# Altium schematic sheet Flash.SchDoc
size 420 x 297 mm
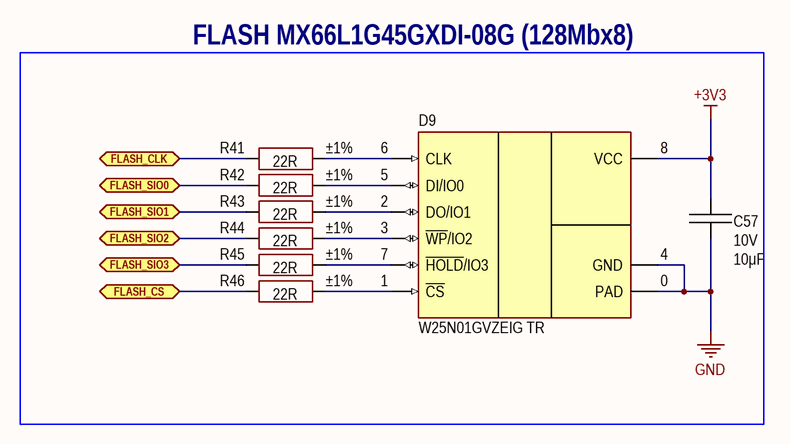
[diagram p0: Flash.SchDoc]

## Parts
C57  value 10μF  Voltage: 10V  [CAP: 0805]
D9  (no value)  [IC: 8-WSON]
R41  value 22R  Tolerance: ±1%  [RES: 0805]
R42  value 22R  Tolerance: ±1%  [RES: 0805]
R43  value 22R  Tolerance: ±1%  [RES: 0805]
R44  value 22R  Tolerance: ±1%  [RES: 0805]
R45  value 22R  Tolerance: ±1%  [RES: 0805]
R46  value 22R  Tolerance: ±1%  [RES: 0805]

## Blocks framed on the sheet
FLASH MX66L1G45GXDI-08G (128Mbx8): C57 D9 R41-R46

## Ports
FLASH_CLK (bidir), FLASH_CS (bidir), FLASH_SIO0 (bidir), FLASH_SIO1 (bidir), FLASH_SIO2 (bidir), FLASH_SIO3 (bidir)

## Nets
+3V3: C57.2 D9.8(VCC)
GND: C57.1 D9.0(PAD) D9.4(GND)
FLASH_CLK: R41.1 ; port FLASH_CLK
FLASH_CS: R46.1 ; port FLASH_CS
FLASH_SIO0: R42.1 ; port FLASH_SIO0
FLASH_SIO1: R43.1 ; port FLASH_SIO1
FLASH_SIO2: R44.1 ; port FLASH_SIO2
FLASH_SIO3: R45.1 ; port FLASH_SIO3
NetD9_1: D9.1(~{CS}) R46.2
NetD9_2: D9.2(DO/IO1) R43.2
NetD9_3: D9.3(~{WP}/IO2) R44.2
NetD9_5: D9.5(DI/IO0) R42.2
NetD9_6: D9.6(CLK) R41.2
NetD9_7: D9.7(~{HOLD}/IO3) R45.2

## Notes on the sheet
- Author
- Manufacturer
- Date
- Page
- Total pages
- Size page
- A3
- Materials

## Library data of the parts
C57 = Ceramic_0805: 10 µF ±10% 10V Ceramic Capacitor X7R 0805 (2012 Metric); Manufacturer: Yageo; PartNumber: CC0805KFX7R6BB106; ValueManufacturerPartNumber: Ceramic capacitor, 10μF, X7R, ±10%, 10V, 0805, -55...+125°C; Package: 0805; HelpURL: https://www.digikey.com/en/products/detail/yageo/CC0805KFX7R6BB106/11611326; Temperature: -55...+125°C; TypeCapacitor: Ceramic capacitor; Tolerance: ±10%; TypeDielectric: X7R
D9 = W25N01GVZEIG TR: FLASH; Manufacturer: Winbond Electronics; ValueManufacturerPartNumber: IC memory, FLASH, 1gb (128M x 8), 133 MHz, SPI/QuadSPI, 2.7...3.6V, -40...+85°C, 8-WDFN; Supply: 2.7...3.6V; Speed: 133 MHz; InterfaceData: SPI/QuadSPI; MemorySize: 1gb (128M x 8); HelpURL: https://www.digikey.com/en/products/detail/winbond-electronics/W25N01GVZEIG-TR/5803931; Package: 8-WDFN; ComponentType: IC memory; Temperature: -40...+85°C; MemoryType: FLASH; PartNumber: W25N01GVZEIG TR
R41-R46 = Resistor_0805: 22 Ohms ±1% 0.125W, 1/8W Chip Resistor 0805 (2012 Metric) Moisture Resistant Thick Film; Manufacturer: Yageo; PartNumber: RC0805FR-0722RL; ValueManufacturerPartNumber: Resistor film, 22R, ±1%, 0805, 0.125W, -55...+125°C; TypeResistor: Resistor film; Package: 0805; HelpURL: https://www.digikey.com/en/products/detail/yageo/RC0805FR-0722RL/727735; Temperature: -55...+125°C; Power: 0.125W